# EAGLE board dac2_v2 (EAGLE 5.12)
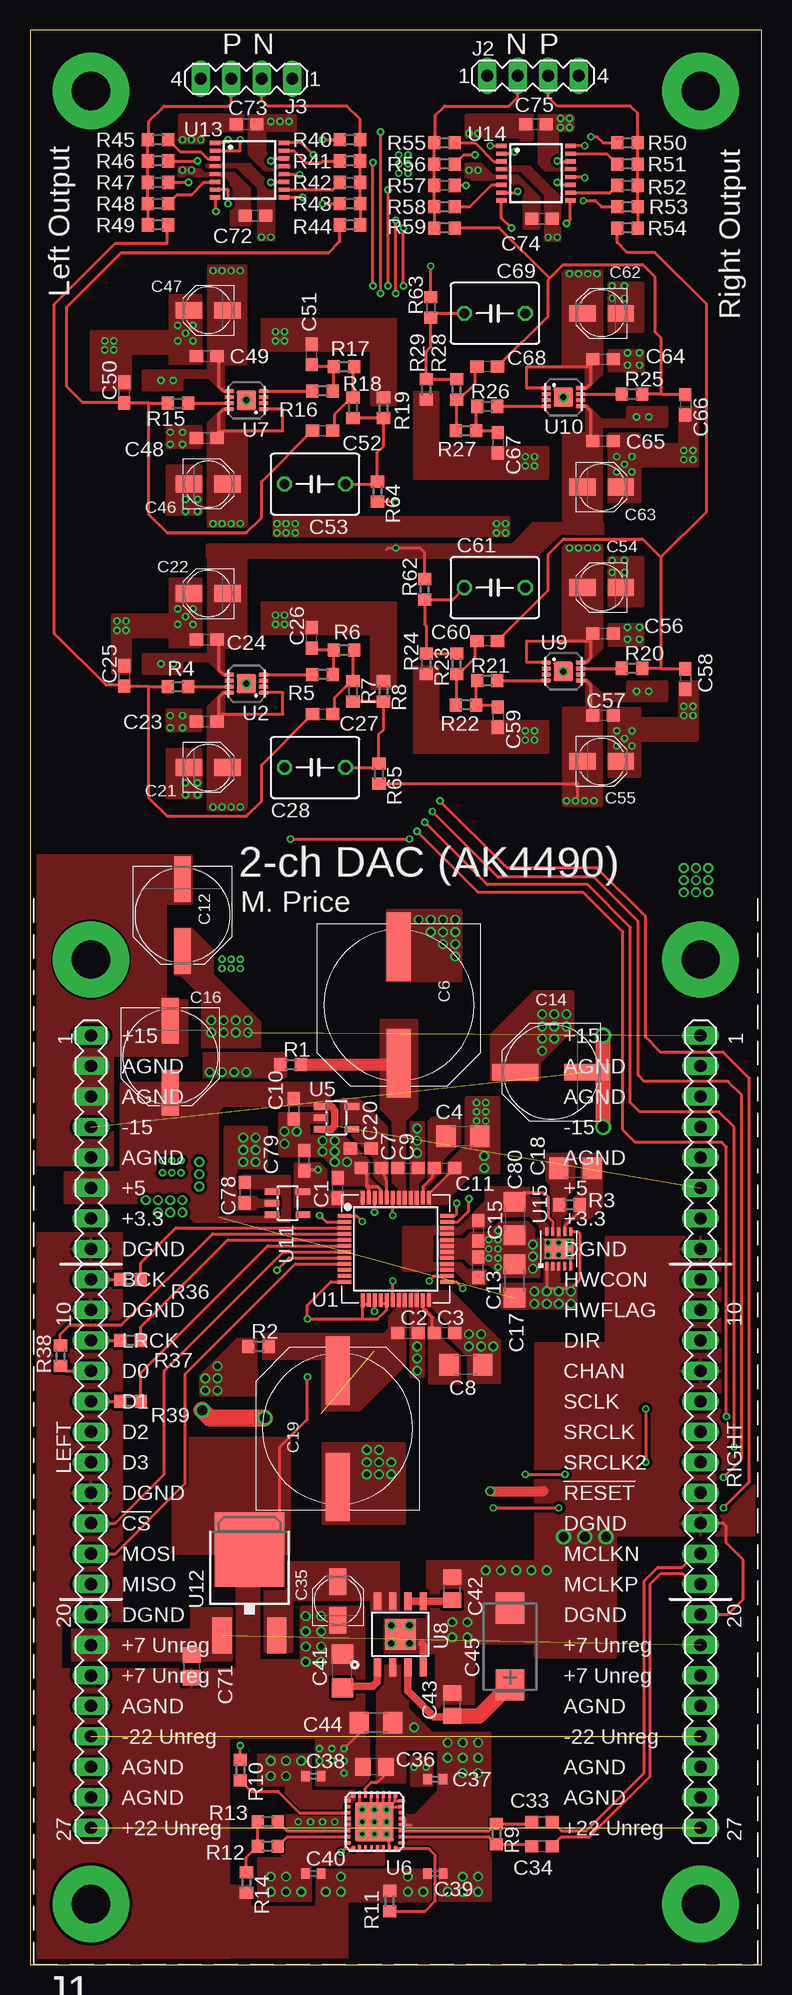
[diagram p2: board, top side]
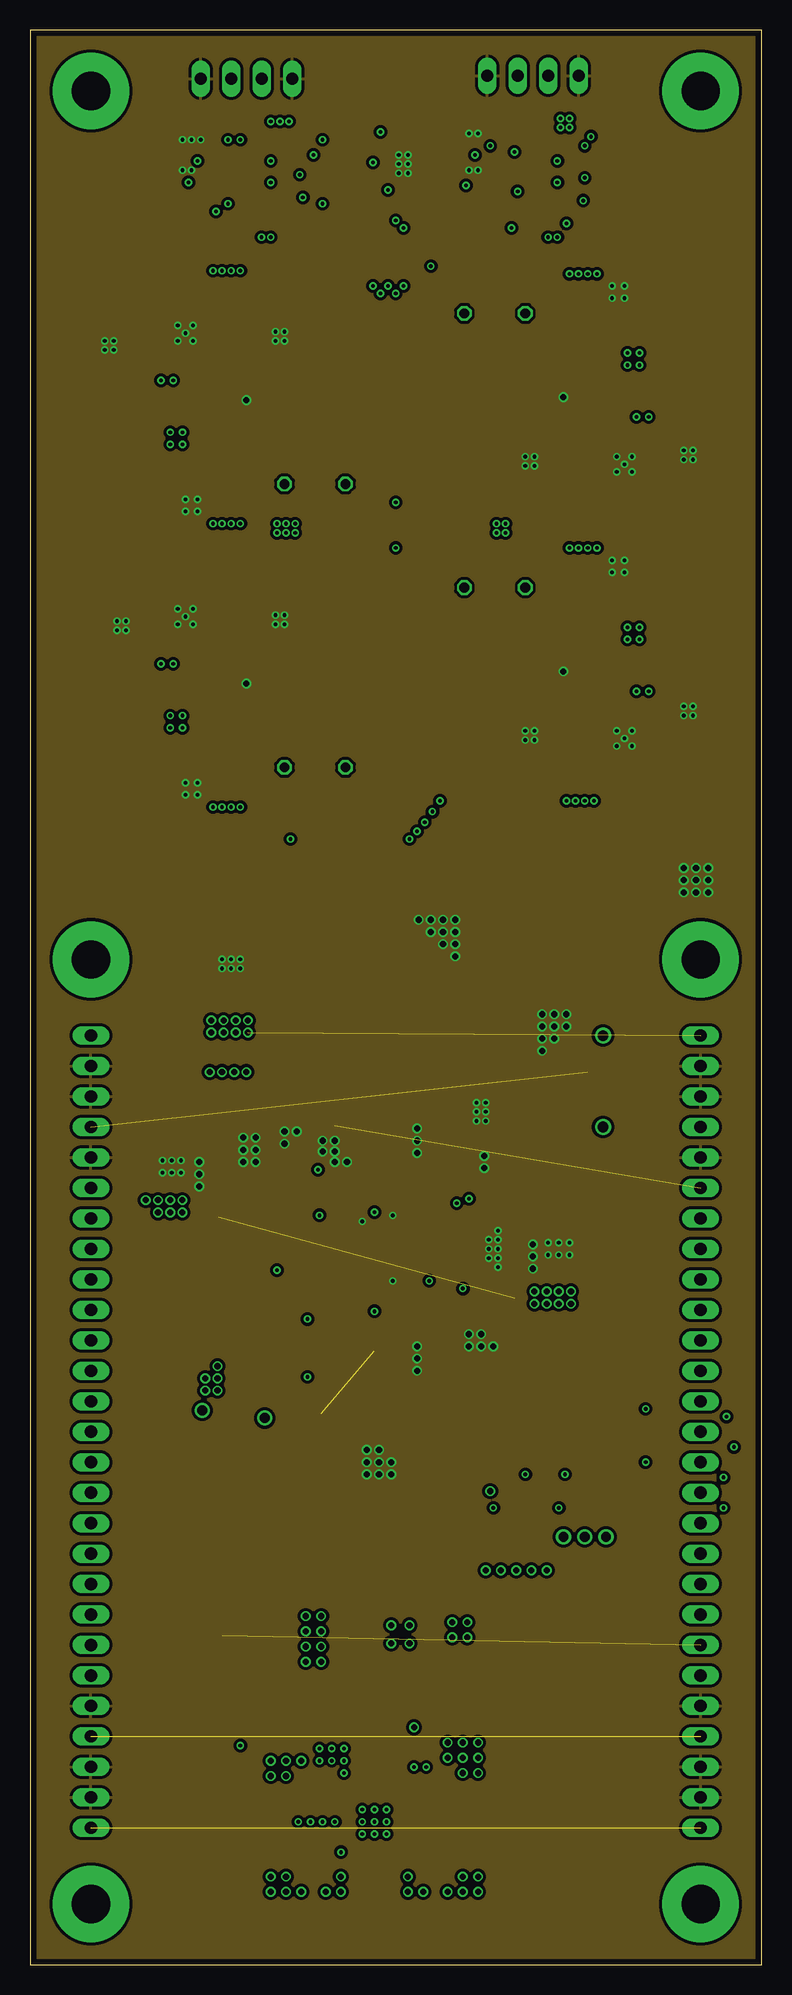
[diagram p3: board, inner layer Route2]
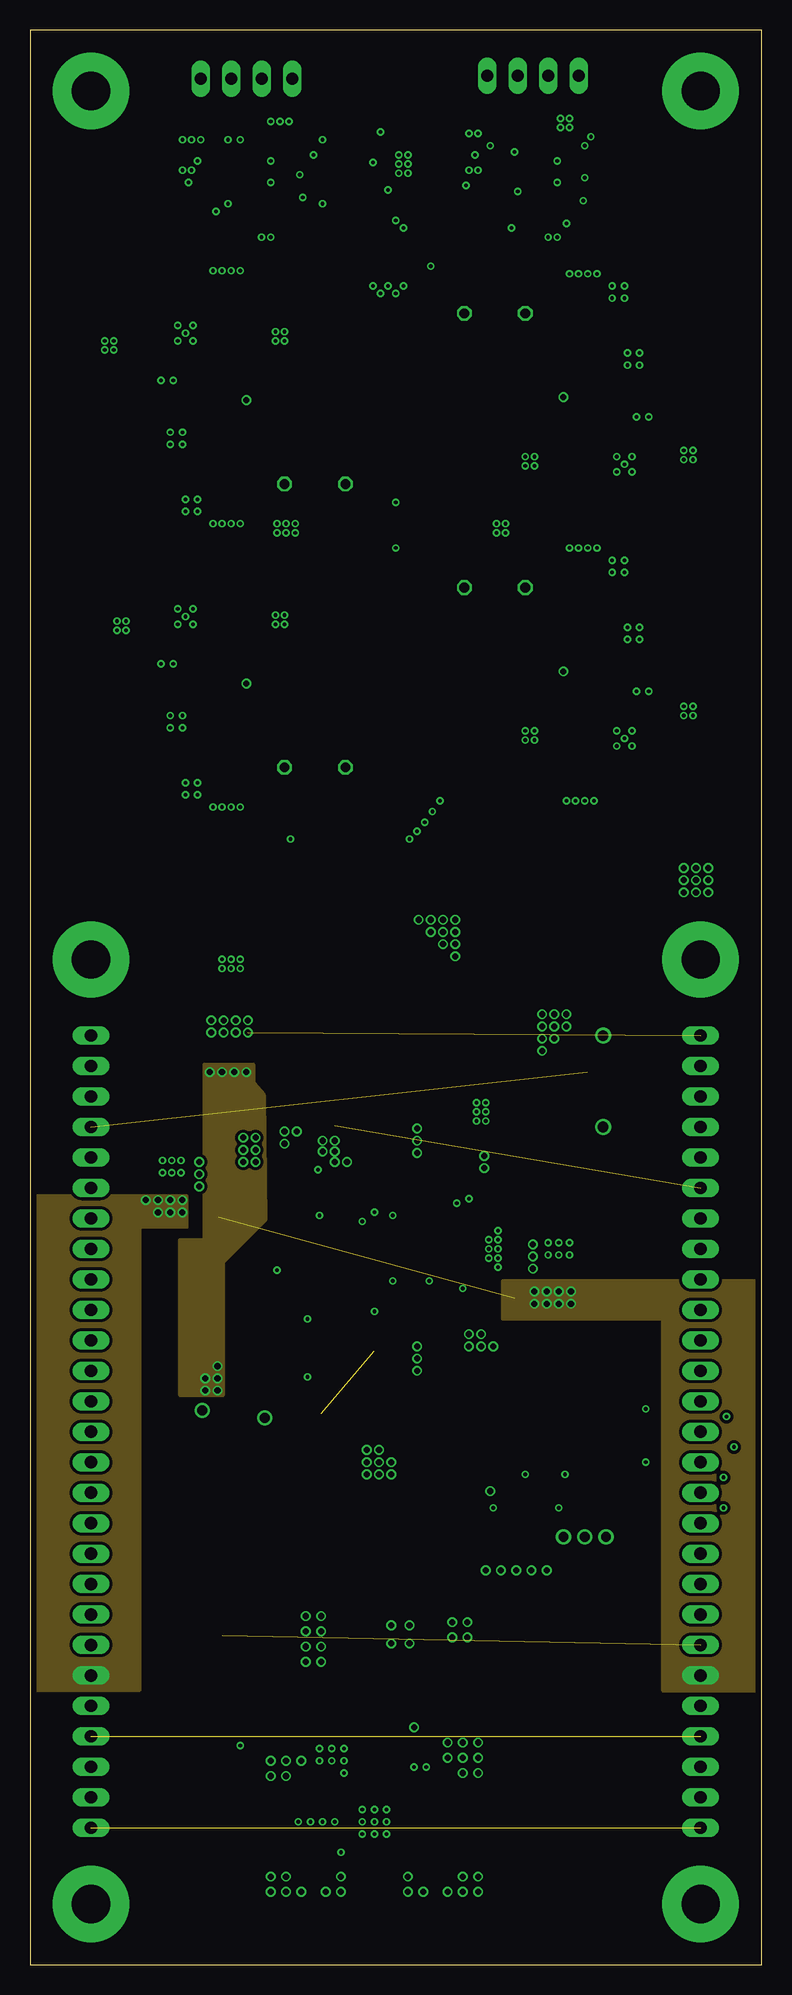
[diagram p4: board, inner layer Route15]
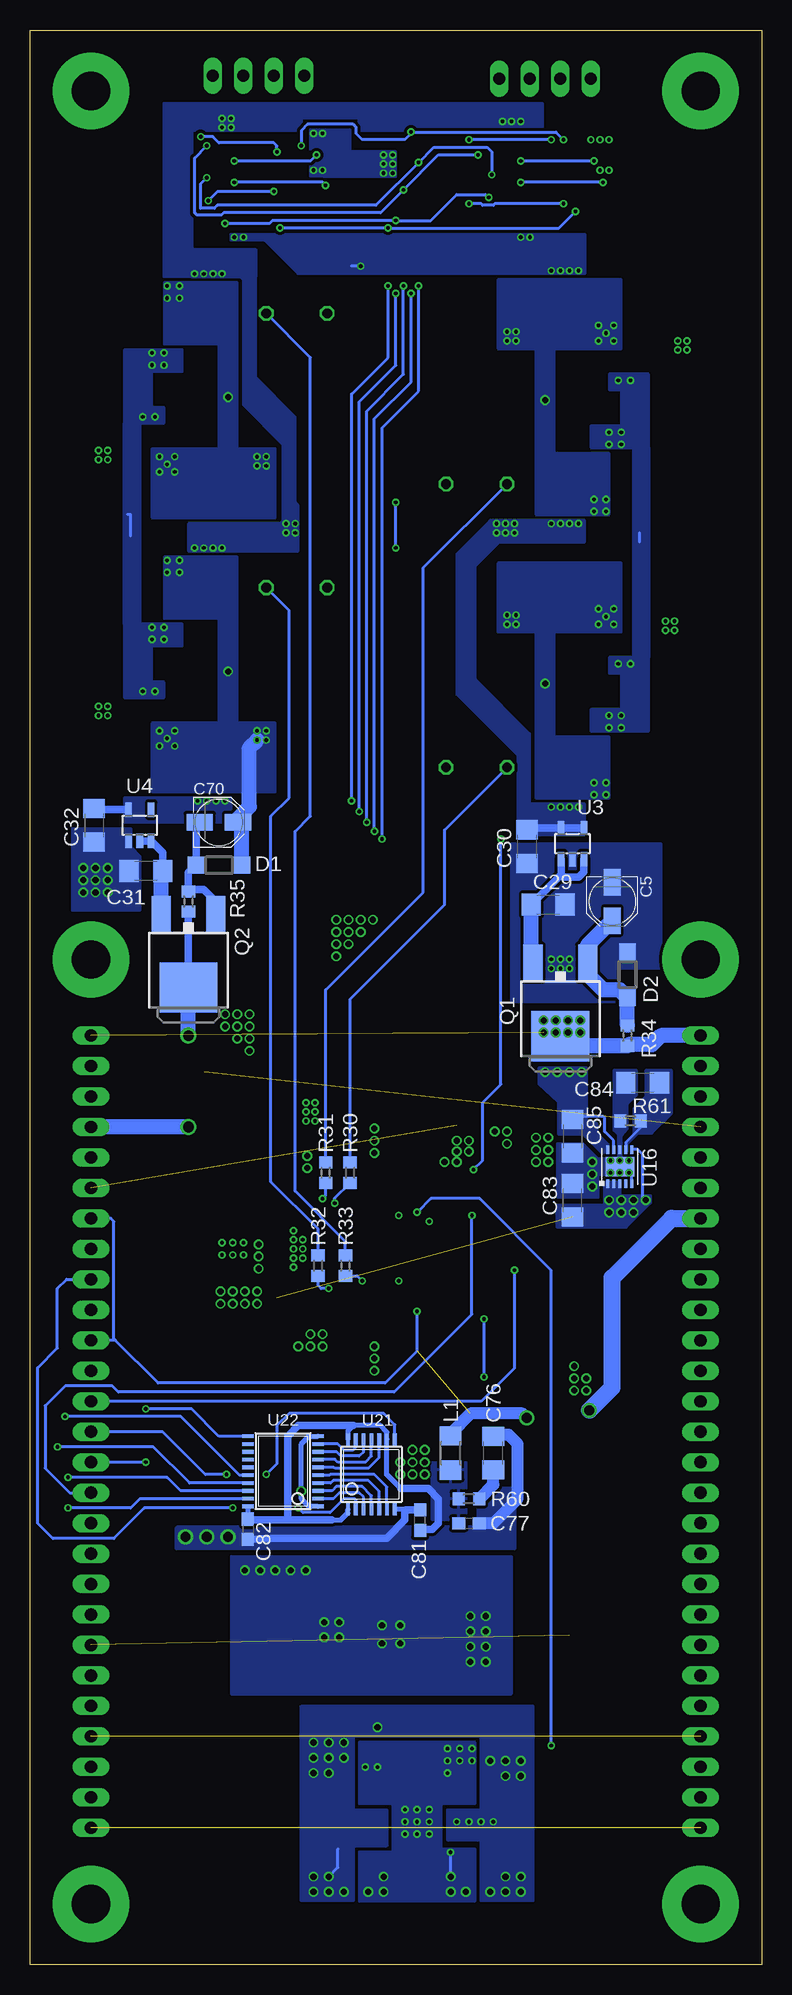
[diagram p5: board, bottom side, seen from below]

Size 60.96 x 161.29 mm. Coordinates in mm from the lower left corner, seen from the top.
Outline: 0,0 60.96,0 60.96,161.29 0,161.29 0,0
Copper layers (1*2*15*16): Top 0.035mm / dielectric 0.2mm / Route2 0.035mm / dielectric 1.2mm / Route15 0.035mm / dielectric 0.2mm / Bottom 0.035mm
Design rules "Elecrow_4-layer_PCB_eagle_rule": minimum track width 6mil, minimum drill 12mil, track to track 6mil, track to pad 6mil, pad to pad 6mil, via to via 8mil, smd to smd 0mil, copper to edge 20mil, drill to drill 10mil, minimum pad ring 6mil, minimum via ring 6mil, stop-mask expansion 0mil, vias tented up to drill 100mil, thermal gap 10mil

## Footprints (pad centres in the part's own frame; a part is rotated, then mirrored left to right if it is on the bottom)
C0603 = smd 1.1 x 1: 1 -0.85,0; 2 0.85,0
C1206 = smd 1.6 x 1.8: 1 -1.4,0; 2 1.4,0
PANASONIC_B = smd 2.2 x 1.4: + 1.6,0; - -1.6,0
PANASONIC_H13 = smd 5.7 x 2: + 4.85,0; - -4.85,0
PANASONIC_E = smd 3.8 x 1.4: + 3,0; - -3,0
C050-050X075 = drill 0.813 octagon: 1 -2.54,0; 2 2.54,0
C0805 = smd 1.3 x 1.5: 1 -0.95,0; 2 0.95,0
C0402 = smd 0.7 x 0.9: 1 -0.65,0; 2 0.65,0
CT7343 = smd 2.6 x 2.4: + -3.2,0; - 3.2,0
SOD123 = smd 1.4 x 1.4: A 1.9,0; C -1.9,0
MOD-V2 = drill 1.016 long: 1L -25.4,33.02; 1R 25.4,33.02; 2L -25.4,30.48; 2R 25.4,30.48; 3L -25.4,27.94; 3R 25.4,27.94; 4L -25.4,25.4; 4R 25.4,25.4; 5L -25.4,22.86; 5R 25.4,22.86; 6L -25.4,20.32; 6R 25.4,20.32; 7L -25.4,17.78; 7R 25.4,17.78; 8L -25.4,15.24; 8R 25.4,15.24; 9L -25.4,12.7; 9R 25.4,12.7; 10L -25.4,10.16; 10R 25.4,10.16; 11L -25.4,7.62; 11R 25.4,7.62; 12L -25.4,5.08; 12R 25.4,5.08; 13L -25.4,2.54; 13R 25.4,2.54; 14L -25.4,0; 14R 25.4,0; 15L -25.4,-2.54; 15R 25.4,-2.54; 16L -25.4,-5.08; 16R 25.4,-5.08; 17L -25.4,-7.62; 17R 25.4,-7.62; 18L -25.4,-10.16; 18R 25.4,-10.16; 19L -25.4,-12.7; 19R 25.4,-12.7; 20L -25.4,-15.24; 20R 25.4,-15.24; 21L -25.4,-17.78; 21R 25.4,-17.78; 22L -25.4,-20.32; 22R 25.4,-20.32; 23L -25.4,-22.86; 23R 25.4,-22.86; 24L -25.4,-25.4; 24R 25.4,-25.4; 25L -25.4,-27.94; 25R 25.4,-27.94; 26L -25.4,-30.48; 26R 25.4,-30.48; 27L -25.4,-33.02; 27R 25.4,-33.02 | drill 3.175 pad 6.35 round: DP1 -25.4,39.37; DP2 25.4,39.37; DP3 -25.4,-39.37; DP4 25.4,-39.37
MA04-1 = drill 1.016 long: 1 -3.81,0; 2 -1.27,0; 3 1.27,0; 4 3.81,0
R1206 = smd 1.6 x 1.803: 1 -1.422,0; 2 1.422,0
DPAK = smd 1.6 x 3: 1 -2.28,-4.04; 3 2.28,-4.04 | smd 4.826 x 4.191: 2 0,2.096
R0603 = smd 1 x 1.1: 1 -0.85,0; 2 0.85,0
P-QFP48-7X7MM = smd 1.1 x 0.3: 1 -4.275,2.75; 2 -4.275,2.25; 3 -4.275,1.75; 4 -4.275,1.25; 5 -4.275,0.75; 6 -4.275,0.25; 7 -4.275,-0.25; 8 -4.275,-0.75; 9 -4.275,-1.25; 10 -4.275,-1.75; 11 -4.275,-2.25; 12 -4.275,-2.75; 25 4.275,-2.75; 26 4.275,-2.25; 27 4.275,-1.75; 28 4.275,-1.25; 29 4.275,-0.75; 30 4.275,-0.25; 31 4.275,0.25; 32 4.275,0.75; 33 4.275,1.25; 34 4.275,1.75; 35 4.275,2.25; 36 4.275,2.75 | smd 0.3 x 1.1: 13 -2.75,-4.275; 14 -2.25,-4.275; 15 -1.75,-4.275; 16 -1.25,-4.275; 17 -0.75,-4.275; 18 -0.25,-4.275; 19 0.25,-4.275; 20 0.75,-4.275; 21 1.25,-4.275; 22 1.75,-4.275; 23 2.25,-4.275; 24 2.75,-4.275; 37 2.75,4.275; 38 2.25,4.275; 39 1.75,4.275; 40 1.25,4.275; 41 0.75,4.275; 42 0.25,4.275; 43 -0.25,4.275; 44 -0.75,4.275; 45 -1.25,4.275; 46 -1.75,4.275; 47 -2.25,4.275; 48 -2.75,4.275
LFCSP8 = smd 0.8 x 0.34: 1 -1.425,0.75; 2 -1.425,0.25; 3 -1.425,-0.25; 4 -1.425,-0.75; 5 1.425,-0.75; 6 1.425,-0.25; 7 1.425,0.25; 8 1.425,0.75 | smd 1.6 x 1.6: EXP 0,0
SOT23-DBV = smd 0.55 x 1.2: 1 -0.95,-1.3; 2 0,-1.3; 3 0.95,-1.3; 4 0.95,1.3; 5 -0.95,1.3
LFCSP32 = smd 0.55 x 0.3: 1 -2.25,1.75; 2 -2.25,1.25; 3 -2.25,0.75; 4 -2.25,0.25; 5 -2.25,-0.25; 6 -2.25,-0.75; 7 -2.25,-1.25; 8 -2.25,-1.75; 17 2.25,-1.75; 18 2.25,-1.25; 19 2.25,-0.75; 20 2.25,-0.25; 21 2.25,0.25; 22 2.25,0.75; 23 2.25,1.25; 24 2.25,1.75 | smd 0.3 x 0.55: 9 -1.75,-2.25; 10 -1.25,-2.25; 11 -0.75,-2.25; 12 -0.25,-2.25; 13 0.25,-2.25; 14 0.75,-2.25; 15 1.25,-2.25; 16 1.75,-2.25; 25 1.75,2.25; 26 1.25,2.25; 27 0.75,2.25; 28 0.25,2.25; 29 -0.25,2.25; 30 -0.75,2.25; 31 -1.25,2.25; 32 -1.75,2.25 | smd 3.25 x 3.25: EXP 0,0
SO8-EP = smd 0.61 x 1.524: 1 -1.905,-2.743; 2 -0.635,-2.743; 3 0.635,-2.743; 4 1.905,-2.743; 5 1.905,2.743; 6 0.635,2.743; 7 -0.635,2.743; 8 -1.905,2.743 | smd 2.54 x 2.54: EP 0,0
DPACK = smd 1.6 x 3: 1 -2.28,-4.8; 3 2.28,-4.8 | smd 5.8 x 6.2: 4 0,2.38
TSSOP16 = smd 0.9 x 0.35: 1 -2.875,2.275; 2 -2.875,1.625; 3 -2.875,0.975; 4 -2.875,0.325; 5 -2.875,-0.325; 6 -2.875,-0.975; 7 -2.875,-1.625; 8 -2.875,-2.275; 9 2.875,-2.275; 10 2.875,-1.625; 11 2.875,-0.975; 12 2.875,-0.325; 13 2.875,0.325; 14 2.875,0.975; 15 2.875,1.625; 16 2.875,2.275
DFN10 = smd 0.25 x 0.7: 1 -1,-1.425; 2 -0.5,-1.425; 3 0,-1.425; 4 0.5,-1.425; 5 1,-1.425; 6 1,1.425; 7 0.5,1.425; 8 0,1.425; 9 -0.5,1.425; 10 -1,1.425 | smd 2.38 x 1.65: EP 0,0
TSSOP14 = smd 0.305 x 0.991: 1 -1.95,-2.918; 2 -1.3,-2.918; 3 -0.65,-2.918; 4 0,-2.918; 5 0.65,-2.918; 6 1.3,-2.918; 7 1.95,-2.918; 8 1.95,2.918; 9 1.3,2.918; 10 0.65,2.918; 11 0,2.918; 12 -0.65,2.918; 13 -1.3,2.918; 14 -1.95,2.918
TSSOP20 = smd 0.305 x 0.991: 1 -2.925,-2.918; 2 -2.275,-2.918; 3 -1.625,-2.918; 4 -0.975,-2.918; 5 -0.325,-2.918; 6 0.325,-2.918; 7 0.975,-2.918; 8 1.625,-2.918; 9 2.275,-2.918; 10 2.925,-2.918; 11 2.925,2.918; 12 2.275,2.918; 13 1.625,2.918; 14 0.975,2.918; 15 0.325,2.918; 16 -0.325,2.918; 17 -0.975,2.918; 18 -1.625,2.918; 19 -2.275,2.918; 20 -2.925,2.918

## Placement (x,y rotation side)
C1  0.1u  [C0603]  25.65,64.77 90 top
C2  0.1u  [C0603]  31.5,52.7 0 top
C3  0.1u  [C0603]  34.54,52.7 0 top
C4  10u  [C1206]  36.07,69.09 0 top
C5  10u  [PANASONIC_B]  12.45,88.65 270 bottom
C6  2200u  [PANASONIC_H13]  30.73,80.01 270 top
C7  0.1u  [C0603]  28.45,66.42 180 top
C8  10u  [C1206]  36.32,50.04 0 top
C9  0.1u  [C0603]  31.5,66.42 0 top
C10  1u  [C0603]  21.97,71.37 270 top
C11  0.1u  [C0603]  34.54,66.42 0 top
C12  100u  [PANASONIC_E]  12.7,87.5 270 top
C13  0.1u  [C0603]  37.34,58.17 90 top
C14  100u  [PANASONIC_E]  43.43,74.42 180 top
C15  0.1u  [C0603]  37.34,61.21 270 top
C16  220u  [PANASONIC_E]  11.68,75.69 270 top
C17  4.7u  [C1206]  40.39,57.02 90 top
C18  4.7u  [C1206]  45.47,66.42 180 top
C19  2200u  [PANASONIC_H13]  25.65,44.7 90 top
C20  1u  [C0603]  27.56,68.07 180 top
C21  10u  [PANASONIC_B]  14.86,99.82 0 top
C22  10u  [PANASONIC_B]  14.86,114.3 180 top
C23  0.1u  [C0603]  14.73,103.63 180 top
C24  0.1u  [C0603]  14.73,110.49 0 top
C25  1n  [C0603]  7.87,107.44 90 top
C26  3.3n  [C0603]  23.5,110.62 90 top
C27  4.7n  [C0603]  24.38,104.27 0 top
C28  1u  [C050-050X075]  23.75,99.82 0 top
C29  10u  [C1206]  17.78,88.39 0 bottom
C30  10u  [C1206]  19.56,93.22 270 bottom
C31  10u  [C1206]  51.31,91.19 180 bottom
C32  10u  [C1206]  55.63,95 270 bottom
C33  10n  [C0603]  42.67,11.94 0 top
C34  10n  [C0603]  42.67,9.91 0 top
C35  10u  [PANASONIC_B]  25.65,30.35 90 top
C36  1u  [C0805]  28.7,16.51 180 top
C37  10n  [C0402]  33.78,15.49 180 top
C38  10n  [C0402]  23.62,15.75 0 top
C39  10n  [C0402]  33.78,7.62 180 top
C40  10n  [C0402]  23.62,7.62 0 top
C41  10u  [C1206]  26.04,24.51 90 top
C42  1u  [C0805]  35.18,31.37 90 top
C43  1u  [C0805]  35.18,21.72 90 top
C44  10u  [C1206]  28.83,20.19 180 top
C45  330u  [CT7343]  40.01,26.54 90 top
C46  10u  [PANASONIC_B]  14.86,123.44 0 top
C47  10u  [PANASONIC_B]  14.86,137.92 180 top
C48  0.1u  [C0603]  14.73,127.25 180 top
C49  0.1u  [C0603]  14.73,134.11 0 top
C50  1n  [C0603]  7.87,131.06 90 top
C51  3.3n  [C0603]  23.5,134.24 90 top
C52  4.7n  [C0603]  24.38,127.89 0 top
C53  1u  [C050-050X075]  23.75,123.44 0 top
C54  10u  [PANASONIC_B]  47.62,114.81 180 top
C55  10u  [PANASONIC_B]  47.62,100.33 0 top
C56  0.1u  [C0603]  47.75,111 0 top
C57  0.1u  [C0603]  47.75,104.14 180 top
C58  1n  [C0603]  54.61,107.19 270 top
C59  3.3n  [C0603]  38.99,104.01 270 top
C60  4.7n  [C0603]  38.1,110.36 180 top
C61  1u  [C050-050X075]  38.73,114.81 180 top
C62  10u  [PANASONIC_B]  47.62,137.67 180 top
C63  10u  [PANASONIC_B]  47.62,123.19 0 top
C64  0.1u  [C0603]  47.75,133.86 0 top
C65  0.1u  [C0603]  47.75,127 180 top
C66  1n  [C0603]  54.61,130.05 270 top
C67  3.3n  [C0603]  38.99,126.87 270 top
C68  4.7n  [C0603]  38.1,133.22 180 top
C69  1u  [C050-050X075]  38.73,137.67 180 top
C70  10u  [PANASONIC_B]  45.21,95.25 0 bottom
C71  1u  [C0805]  13.46,24.89 270 top
C72  0.1u  [C0603]  18.8,145.8 180 top
C73  0.1u  [C0603]  18.03,153.42 180 top
C74  0.1u  [C0603]  42.67,145.54 180 top
C75  0.1u  [C0603]  42.16,153.42 180 top
C76  10u  [C1206]  22.35,42.67 90 bottom
C77  1u  [C0603]  24.38,36.83 0 bottom
C78  1u  [C0603]  17.91,64.39 270 top
C79  1u  [C0603]  22.86,67.06 90 top
C80  4.7u  [C1206]  40.39,62.23 270 top
C81  0.1u  [C0603]  28.45,37.08 90 bottom
C82  0.1u  [C0603]  42.8,36.32 270 bottom
C83  4.7u  [C1206]  15.75,63.75 90 bottom
C84  4.7u  [C1206]  9.91,73.53 180 bottom
C85  4.7u  [C1206]  15.75,69.09 270 bottom
D1  MMSZ5235B  [SOD123]  45.21,91.69 180 bottom
D2  MMSZ5235B  [SOD123]  11.18,82.55 90 bottom
J1  MOD-V2  [MOD-V2]  30.48,44.45 0 top
J2  [MA04-1]  41.91,157.48 0 top
J3  [MA04-1]  18.03,157.23 180 top
L1  BEAD  [R1206]  25.91,42.67 270 bottom
Q1  D44H11MT  [DPAK]  16.76,79.5 180 bottom
Q2  D45H11MT  [DPAK]  47.75,83.57 180 bottom
R1  0  [R0603]  21.72,75.06 0 top
R2  0  [R0603]  19.05,51.56 0 top
R3  49.9k  [R0603]  44.96,63.37 0 top
R4  10  [R0603]  12.32,106.55 180 top
R5  24.9  [R0603]  24.38,107.57 180 top
R6  249  [R0603]  26.16,109.6 180 top
R7  249  [R0603]  26.92,106.17 90 top
R8  100k  [R0603]  29.46,106.17 270 top
R9  100  [R0603]  38.86,10.92 270 top
R10  22  [R0603]  17.53,16.26 270 top
R11  4.12k  [R0603]  29.97,5.33 270 top
R12  50  [R0603]  19.81,9.91 0 top
R13  50  [R0603]  19.81,11.94 0 top
R14  50  [R0603]  18.03,6.86 270 top
R15  10  [R0603]  12.32,130.18 180 top
R16  24.9  [R0603]  24.38,131.19 180 top
R17  249  [R0603]  26.16,133.22 180 top
R18  249  [R0603]  26.92,129.79 90 top
R19  100k  [R0603]  29.46,129.79 270 top
R20  10  [R0603]  50.16,108.08 0 top
R21  24.9  [R0603]  38.1,107.06 0 top
R22  249  [R0603]  36.32,105.03 0 top
R23  249  [R0603]  35.56,108.46 270 top
R24  100k  [R0603]  33.02,108.46 90 top
R25  10  [R0603]  50.16,130.94 0 top
R26  24.9  [R0603]  38.1,129.92 0 top
R27  249  [R0603]  36.32,127.89 0 top
R28  249  [R0603]  35.56,131.32 270 top
R29  100k  [R0603]  33.02,131.32 90 top
R30  100  [R0603]  34.29,66.04 90 bottom
R31  100  [R0603]  36.32,66.04 90 bottom
R32  100  [R0603]  36.96,58.29 90 bottom
R33  100  [R0603]  34.67,58.29 90 bottom
R34  825  [R0603]  11.18,77.47 90 bottom
R35  825  [R0603]  47.75,88.65 90 bottom
R36  50  [R0603]  8.38,57.15 180 top
R37  50  [R0603]  8.38,52.07 180 top
R38  50  [R0603]  2.54,50.8 270 top
R39  50  [R0603]  8.38,46.99 180 top
R40  45.3  [R0603]  26.67,152.15 180 top
R41  10.5  [R0603]  26.67,150.37 180 top
R42  2.49  [R0603]  26.67,148.59 180 top
R43  0  [R0603]  26.67,146.81 180 top
R44  90.9  [R0603]  26.67,145.03 180 top
R45  45.3  [R0603]  10.67,152.15 180 top
R46  10.5  [R0603]  10.67,150.37 180 top
R47  2.49  [R0603]  10.67,148.59 180 top
R48  0  [R0603]  10.67,146.81 180 top
R49  90.9  [R0603]  10.67,145.03 0 top
R50  45.3  [R0603]  49.78,151.89 180 top
R51  10.5  [R0603]  49.78,150.11 180 top
R52  2.49  [R0603]  49.78,148.34 180 top
R53  0  [R0603]  49.78,146.56 180 top
R54  90.9  [R0603]  49.78,144.78 180 top
R55  45.3  [R0603]  34.54,151.89 180 top
R56  10.5  [R0603]  34.54,150.11 180 top
R57  2.49  [R0603]  34.54,148.34 180 top
R58  0  [R0603]  34.54,146.56 180 top
R59  90.9  [R0603]  34.54,144.78 0 top
R60  1  [R0603]  24.38,38.86 180 bottom
R61  49.9k  [R0603]  10.92,70.36 0 bottom
R62  50Meg  [R0603]  32.89,114.68 90 top
R63  50Meg  [R0603]  33.4,138.18 90 top
R64  50Meg  [R0603]  28.96,122.81 270 top
R65  50Meg  [R0603]  29.08,99.31 270 top
U1  AK4490  [P-QFP48-7X7MM]  30.48,59.69 0 top
U2  ADA4899-1  [LFCSP8]  18.03,106.81 180 top
U3  ADP7142  [SOT23-DBV]  15.75,93.47 0 bottom
U4  ADP7182  [SOT23-DBV]  51.82,95 0 bottom
U5  ADM7160  [SOT23-DBV]  25.53,70.61 270 top
U6  AD9515  [LFCSP32]  28.7,11.94 180 top
U7  ADA4899-1  [LFCSP8]  18.03,130.43 180 top
U8  ADM7154  [SO8-EP]  30.86,27.56 0 top
U9  ADA4899-1  [LFCSP8]  44.45,107.82 0 top
U10  ADA4899-1  [LFCSP8]  44.45,130.68 0 top
U11  ADM7160  [SOT23-DBV]  21.46,63.5 270 top
U12  LF50ABDT  [DPACK]  18.29,32.26 0 top
U13  DG9424E  [TSSOP16]  18.29,149.61 0 top
U14  DG9424E  [TSSOP16]  42.16,149.35 0 top
U15  LT3042DD  [DFN10]  44.07,59.69 0 top
U16  LT3042DD  [DFN10]  11.81,66.55 0 bottom
U21  74164FT  [TSSOP14]  32.51,40.89 0 bottom
U22  74LVTH574  [TSSOP20]  39.88,41.15 90 bottom

## Tracks (layer width: path | path; a pad name or v marks a point on that pad's centre or on a via)
!CS
  Top 0.254: J1.17L 7.11,36.83 11.18,40.89 11.18,49.53 21.09,59.44 U1.7
!RESET  (via drill 0.3 pad 0.51)
  Top 0.254: U1.2 24.67,61.94 v24.13,62.48
  Bottom 0.254: v24.13,62.48 24.13,54.23 30.61,47.75 53.59,47.75 54.1,48.26 58.04,48.26 59.69,46.61 59.69,41.4 57.66,39.37 J1.16R
A3V3
  Top 0.254: C7.1 29.73,65.35 U1.44
  pour Top (no thermals): 29.72,64.77 29.72,69.85 27.43,72.14 25.91,72.14 25.91,70.1 28.7,67.31 28.7,65.79
A5V  (1 unrouted)
  Top 0.61: U5.1 25.09,71.56 25.4,71.25 25.4,69.98 25.09,69.66 U5.3
  pour Top (isolate 0.254, no thermals): 17.78,65.79 21.59,65.79 21.59,61.98 13.72,61.98 12.19,63.5 2.92,63.5 2.92,66.04 7.62,66.04 7.62,73.53 24.89,73.53 24.89,71.63 16.13,71.63 15.62,71.12 15.62,62.36 21.08,62.36 21.08,64.26 19.68,64.26 19.68,64.77 17.78,64.77
A5VDAC
  Top 0.254: U15.9 43.57,61.97 43.18,62.36 43.18,64.01 42.8,64.39 41.15,64.39 C80.1
  pour Top (isolate 0.254, no thermals): 39.12,62.48 39.12,64.77 41.53,64.77 41.53,64.01 41.66,63.88 42.42,63.88 42.42,62.36 43.18,61.59 43.18,60.96 42.55,60.96 42.55,61.59 41.66,62.48
  pour Top (isolate 0.254, no thermals): 33.91,60.96 35.94,60.96 36.45,61.47 37.97,61.47 38.99,62.48 39.37,62.48 40.64,62.48 40.64,64.77 37.97,64.77 37.97,63.63 35.81,61.47 33.91,61.47
  pour Top (isolate 0.254, no thermals): 37.97,57.91 36.45,57.91 35.94,58.42 33.53,58.42 33.53,60.96 35.05,60.96 35.05,61.47 31.11,61.47 31.11,57.91 35.43,57.91 36.58,56.77 37.97,56.77
A5VREF  (via drill 0.51 pad 0.81)
  Bottom 0.254: U16.9 12.32,68.71 13.08,69.47 13.08,70.61 13.21,70.74 15.11,70.74 15.36,70.49 C85.1
  other vias: 14.99,74.42 16,74.42 17.02,74.42 18.03,74.42 14.61,48.9 14.61,47.88 15.62,47.88 15.62,48.9 15.62,49.91
  pour Bottom (isolate 0.254, no thermals): 14.61,74.8 14.61,70.23 13.84,70.23 13.72,70.1 13.72,69.34 12.83,68.45 12.83,67.69 13.34,67.69 14.86,69.22 16.89,69.22 16.89,71.88 18.54,73.41 18.54,74.8
  pour Top (isolate 0.254, no thermals): 21.34,75.95 14.48,75.95 14.48,74.04 21.34,74.04
  pour Top (isolate 0.254, no thermals): 18.8,52.2 18.8,47.5 14.22,47.5 14.22,49.15 17.27,52.2
  pour Route15 (isolate 0.254, no thermals): 16.13,47.5 16.13,58.55 19.68,62.1 19.56,72.52 18.67,73.53 18.67,75.06 14.48,75.06 14.48,60.45 12.45,60.45 12.45,47.5
A7VU  (via drill 0.51 pad 0.81)  (1 unrouted)
  Top 0.254: U15.6 45.69,61.12 45.85,60.96 45.85,57.15 45.09,56.39 43.18,56.39 43.05,56.52 43.05,58.25 U15.1
  Bottom 0.254: U16.2 | U16.6 10.31,67.97 9.91,67.56 9.91,64.01 v9.65,63.75
  other vias: 11.68,63.75 12.7,63.75 10.67,63.75 42.04,55.12 42.04,56.13 43.05,56.13 43.05,55.12 44.07,55.12 44.07,56.13 45.09,56.13 45.09,55.12 10.67,62.74 11.68,62.74 12.7,62.74
  pour Bottom (isolate 0.254, no thermals): 17.02,63.37 13.08,63.37 13.08,65.28 11.81,65.28 11.81,64.14 9.27,64.14 9.27,63.5 11.3,61.47 17.02,61.47
  pour Top (isolate 0.254, no thermals): 39.37,56.77 42.93,56.77 42.93,58.42 44.07,58.42 44.07,56.77 45.47,56.77 45.47,54.74 44.07,54.74 39.37,54.74
  pour Route15 (isolate 0.254, no thermals): 9.14,22.86 0.13,22.86 0.13,64.14 13.08,64.14 13.08,61.47 9.14,61.47
  pour Route15 (isolate 0.254, no thermals): 52.83,22.86 60.83,22.86 60.83,57.02 39.37,57.02 39.37,53.85 52.07,53.85 52.7,53.85 52.7,22.86
AGND  (via drill 0.3 pad 0.51, 0.51 pad 0.81)
  Top 0.254: U15.5 45.07,59.42 45.09,59.44 44.32,59.44 U15.EP | U1.1 27.22,62.44 v27.69,61.98 | U1.18 v30.23,57.02 | 28.96,64.9 28.32,64.9 28.07,65.15 | U1.43 v30.23,62.49 v30.23,62.48 | U1.37 33.23,64.26 C11.2
  Top 0.305: U1.47 28.23,64.73 28.07,64.9 28.07,65.15 28.07,65.95 C7.2 | U1.45 29.23,64.62 28.96,64.9
  Bottom 0.254: U16.5 10.81,66.15 10.79,66.17 11.43,66.17 U16.EP
  Bottom 1.27: D1.C 43.31,94.95 C70.+ 43.61,95.58 42.67,96.52 42.67,101.47 v42.04,102.11
  other vias: 18.03,106.81 12.32,111.76 13.59,111.76 13.59,113.03 12.32,113.03 13.97,98.55 12.95,98.55 12.95,97.54 13.97,97.54 21.21,111.76 20.45,111.76 20.45,112.52 21.21,112.52 12.95,112.39 18.03,130.43 12.32,135.38 13.59,135.38 13.59,136.65 12.32,136.65 13.97,122.17 12.95,122.17 12.95,121.16 13.97,121.16 21.21,135.38 20.45,135.38 20.45,136.14 21.21,136.14 12.95,136.02 44.45,107.82 50.16,102.87 48.9,102.87 48.9,101.6 50.16,101.6 48.51,116.08 49.53,116.08 49.53,117.09 48.51,117.09 41.27,102.87 42.04,102.87 41.27,102.11 49.53,102.23 44.45,130.68 50.16,125.73 48.9,125.73 48.9,124.46 50.16,124.46 48.51,138.94 49.53,138.94 49.53,139.95 48.51,139.95 41.27,125.73 42.04,125.73 42.04,124.97 41.27,124.97 49.53,125.09 54.48,126.24 55.24,126.24 55.24,125.48 54.48,125.48 54.48,104.9 55.24,104.9 55.24,104.14 54.48,104.14 6.99,134.62 6.22,134.62 6.22,135.38 6.99,135.38 8,111.25 7.24,111.25 7.24,112.01 8,112.01 16,83.82 16.76,83.82 17.53,83.82 16,83.06 16.76,83.06 17.53,83.06 12.7,149.61 13.46,149.61 12.7,152.15 13.46,152.15 14.22,152.15 36.58,152.65 36.58,149.61 37.34,149.61 37.34,152.65 30.73,149.35 31.5,149.35 31.5,150.11 30.73,150.11 30.73,150.88 31.5,150.88 32.26,67.69 32.26,68.71 32.26,69.72 32.38,87.12 33.4,87.12 34.42,87.12 35.43,87.12 35.43,86.11 35.43,85.09 35.43,84.07 34.42,86.11 33.4,86.11 34.42,85.09 37.21,71.88 37.97,71.88 37.21,71.12 37.97,71.12 37.21,70.36 37.97,70.36 37.85,66.42 37.85,67.44 38.23,60.45 38.99,60.45 38.23,59.69 38.99,59.69 38.23,58.93 38.99,58.93 38.99,61.21 38.99,58.17 41.91,58.04 41.91,59.05 41.91,60.07 43.18,60.2 43.18,59.18 44.07,60.2 44.96,60.2 44.96,59.18 44.07,59.18 11.05,67.06 11.81,67.06 12.57,67.06 12.57,66.04 11.81,66.04 11.05,66.04 28.07,42.93 29.08,42.93 29.08,41.91 28.07,41.91 28.07,40.89 29.08,40.89 30.1,41.91 30.1,40.89 32.26,51.56 32.26,50.55 32.26,49.53 36.58,52.58 37.59,52.58 37.59,51.56 36.58,51.56 38.61,51.56 26.42,66.93 25.4,66.93 25.4,67.82 25.4,68.71 24.38,68.71 24.38,67.82 22.23,69.47 21.21,69.47 21.21,68.45 54.48,91.44 55.5,91.44 56.52,91.44 56.52,90.42 55.5,90.42 54.48,90.42 54.48,89.41 55.5,89.41 56.52,89.41 42.67,76.2 42.67,77.22 43.69,77.22 42.67,78.23 43.69,78.23 44.7,78.23 42.67,79.25 43.69,79.25 44.7,79.25 14.1,64.9 14.1,65.91 14.1,66.93 17.78,67.94 17.78,66.93 18.8,66.93 18.8,67.94 18.8,68.96 17.78,68.96
  pour Bottom: 18.8,97.28 17.27,97.28 17.27,111.76 18.8,111.76
  pour Bottom: 18.67,97.28 12.7,97.28 12.7,102.36 18.67,102.36
  pour Bottom: 21.97,111.12 11.68,111.12 11.68,116.84 21.97,116.84
  pour Top (no thermals): 14.22,109.86 11.68,109.86 11.68,115.57 14.22,115.57
  pour Top (no thermals): 14.22,97.28 11.43,97.28 11.43,101.35 14.22,101.35
  pour Top (no thermals): 30.48,106.43 30.48,113.54 19.3,113.54 19.3,111 28.45,111 28.45,106.43
  pour Top (no thermals): 8.38,107.7 8.38,110.74 12.95,110.74 12.95,112.52 6.86,112.52 6.86,107.7
  pour Bottom: 18.8,120.9 17.27,120.9 17.27,135.38 18.8,135.38
  pour Bottom: 18.67,120.9 12.7,120.9 12.7,125.98 18.67,125.98
  pour Bottom: 21.97,134.75 11.68,134.75 11.68,140.46 21.97,140.46
  pour Top (no thermals): 14.22,133.48 11.68,133.48 11.68,139.19 14.22,139.19
  pour Top (no thermals): 14.22,120.9 11.43,120.9 11.43,124.97 14.22,124.97
  pour Top (no thermals): 30.48,130.05 30.48,137.16 19.3,137.16 19.3,134.62 28.45,134.62 28.45,130.05
  pour Top (no thermals): 8.38,131.32 8.38,134.37 12.95,134.37 12.95,136.14 5.08,136.14 5.08,131.32
  pour Bottom: 43.69,117.35 45.21,117.35 45.21,102.87 43.69,102.87
  pour Bottom: 43.81,117.35 49.78,117.35 49.78,112.27 43.81,112.27
  pour Bottom: 40.51,103.5 50.8,103.5 50.8,97.79 40.51,97.79
  pour Top (no thermals): 48.26,104.78 50.8,104.78 50.8,99.06 48.26,99.06
  pour Top (no thermals): 48.26,117.35 51.05,117.35 51.05,113.28 48.26,113.28
  pour Top (no thermals): 32,108.2 32,101.09 43.18,101.09 43.18,103.63 34.04,103.63 34.04,108.2
  pour Top (no thermals): 54.1,106.93 54.1,103.89 49.53,103.89 49.53,102.11 55.63,102.11 55.63,106.93
  pour Bottom: 43.69,140.21 45.21,140.21 45.21,125.73 43.69,125.73
  pour Bottom: 43.81,140.21 49.78,140.21 49.78,135.13 43.81,135.13
  pour Bottom: 40.51,126.36 50.8,126.36 50.8,120.65 40.51,120.65
  pour Top (no thermals): 48.26,127.64 50.8,127.64 50.8,121.92 48.26,121.92
  pour Top (no thermals): 48.26,140.21 51.05,140.21 51.05,136.14 48.26,136.14
  pour Top (no thermals): 32,131.06 32,123.95 43.18,123.95 43.18,126.49 34.04,126.49 34.04,131.06
  pour Top (no thermals): 54.1,129.79 54.1,126.75 49.53,126.75 49.53,124.97 55.63,124.97 55.63,129.79
  pour Top (no thermals): 39.12,61.85 38.23,60.96 36.7,60.96 36.2,60.45 34.16,60.45 34.16,58.93 36.2,58.93 36.7,58.42 38.23,58.42 39.24,57.4 42.42,57.4 42.42,58.93 45.34,58.93 45.34,60.45 42.04,60.45 42.04,61.34 41.53,61.85
  pour Top (no thermals): 20.83,70.99 25.15,70.99 25.15,70.23 23.24,70.23 23.24,69.09 26.16,69.09 28.19,67.06 28.19,65.66 29.08,64.77 28.07,64.77 27.81,65.02 25.27,65.02 25.27,66.55 24.38,67.44 20.83,67.44
  pour Top (no thermals): 36.32,72.26 36.32,68.33 34.8,66.8 34.8,65.79 33.4,64.39 33.4,63.5 34.8,63.5 34.8,63.88 36.96,66.04 39.12,66.04 39.12,72.26
  pour Top (no thermals): 33.27,56.13 35.05,56.13 39.12,52.07 39.12,48.51 36.58,48.51 36.58,50.67 34.92,52.32 34.92,53.47 33.27,55.12
  pour Top (no thermals): 31.75,70.23 32.77,70.23 32.77,65.66 32.26,65.15 32.26,63.25 31.75,63.25
  pour Top (no thermals): 31.75,56.26 32.26,56.26 32.26,54.36 32.77,53.85 32.77,49.02 31.75,49.02
  pour Bottom (no thermals): 57.4,94.74 52.58,94.74 52.58,93.22 51.82,92.46 51.82,87.88 57.4,87.88
  pour Bottom (isolate 0.254, no thermals): 20.83,93.47 8.38,93.47 8.38,83.06 12.19,83.06 12.19,80.26 20.83,80.26
  pour Top (no thermals): 24.38,36.83 31.24,36.83 31.24,43.43 24.38,43.43
  pour Top (isolate 0.254, no thermals): 12.45,149.86 13.97,149.86 14.48,149.35 17.02,149.35 18.29,148.08 18.29,145.03 16.76,145.03 16.76,148.59 16.26,149.1 12.45,149.1
  pour Top (isolate 0.254, no thermals): 17.78,154.18 12.45,154.18 12.45,151.89 14.48,151.89 14.48,152.4 14.99,152.91 17.78,152.91
  pour Top (isolate 0.254, no thermals): 36.32,148.84 39.88,148.84 41.15,147.57 41.15,144.78 42.42,144.78 42.42,147.32 40.64,149.1 38.61,149.1 37.59,150.11 36.32,150.11
  pour Top (isolate 0.254, no thermals): 41.91,152.15 41.91,154.18 36.32,154.18 36.32,152.4 40.89,152.4 40.89,152.15
  pour Bottom (isolate 0.254, no thermals): 37.59,153.16 37.59,149.1 30.48,149.1 30.48,151.13 34.29,151.13 34.29,153.16
  pour Route2 (isolate 0.254): 0,0 60.96,0 60.96,161.29 0,161.29
  pour Top (no thermals): 45.34,67.56 43.05,67.56 43.05,65.41 43.43,65.02 43.43,62.61 43.94,62.1 43.94,60.45 44.15,60.45 44.15,62.1 44.7,62.64 44.7,64.14 45.34,64.77
  pour Bottom (no thermals): 11.71,67.31 11.71,69.16 11.18,69.72 11.18,71.75 10.41,72.52 10.41,74.55 12.32,74.55 12.32,69.6 11.94,69.22 11.94,67.31
  pour Bottom (isolate 0.254, no thermals): 11.56,67.18 13.59,67.18 14.86,68.45 17.02,68.45 17.02,64.01 13.59,64.01 13.59,65.91 11.56,65.91
  pour Top (isolate 0.254, no thermals): 29.72,87.88 29.72,82.04 35.94,82.04 35.94,87.88
  pour Top (isolate 0.254, no thermals): 20.57,63.25 18.92,63.25 18.67,62.99 16.26,62.99 16.26,69.85 19.68,69.85 19.68,66.42 17.27,66.42 17.14,66.29 17.14,64.01 18.8,64.01 19.05,63.75 20.57,63.75
  pour Top (isolate 0.254, no thermals): 13.08,75.82 6.86,75.82 6.86,66.67 0.13,66.67 0.13,80.39 13.08,80.39
  pour Top (no thermals): 38.48,75.18 38.48,77.6 42.04,81.15 45.21,81.15 45.21,77.98 42.42,75.18 42.42,73.79 38.48,73.79
  pour Top (no thermals): 13.46,92.46 0.13,92.46 0.13,79.88 11.3,79.88 11.3,88.52 13.46,88.52
AN15V  (via drill 0.89 pad 1.27)  (1 unrouted)
  Top 0.254: 47.75,74.42 C14.-
  Top 1.27: v47.75,69.85 47.75,74.42 v47.75,77.47
  Bottom 0.61: Q2.2 R35.1
  Bottom 1.27: v47.75,69.85 J1.4R | v47.75,77.47 Q2.2
AN22VU  (1 unrouted)
AOUTLN  (via drill 0.3 pad 0.51)
  Top 0.254: U1.35 35.65,61.94 36.58,62.87 v36.58,63.88
  Bottom 0.254: R31.1 36.32,64.14 v36.58,63.88
AOUTLP  (via drill 0.3 pad 0.51)
  Top 0.254: U1.36 35.39,62.44 35.56,62.61 v35.56,63.5
  Bottom 0.254: v35.56,63.5 35.56,63.92 R30.1
AOUTRN  (via drill 0.3 pad 0.51)
  Top 0.254: U1.26 33.69,57.44 v33.27,57.02
  Bottom 0.254: R33.1 33.69,57.44 v33.27,57.02
AOUTRP  (via drill 0.3 pad 0.51)
  Top 0.254: U1.25 35.52,56.94 v36.07,56.39
  Bottom 0.254: R32.1 36.96,56.64 36.7,56.39 v36.07,56.39
AP15V  (via drill 0.51 pad 0.81)  (1 unrouted)
  Bottom 0.254: v17.14,77.72 16.41,77.72 16.41,77.06
  Bottom 1.27: J1.1L 8.38,77.47 9.14,76.71 11.09,76.71 R34.1 15.98,76.62 16.41,77.06 Q1.2
  other vias: 15.11,78.74 16.13,78.74 17.14,78.74 18.16,78.74 15.11,77.72 16.13,77.72 18.16,77.72
  pour Top (no thermals): 12.06,82.55 12.57,82.55 14.35,80.77 14.35,76.58 19.18,76.58 19.18,78.61 15.24,82.55 15.24,84.58 13.46,86.36 12.06,86.36
AP22VU  (1 unrouted)
BCK
  Top 0.254: U1.3 12.16,61.44 9.23,58.51 R36.1
BCK_CONN
  Top 0.254: J1.9L R36.2
D3V3  (via drill 0.3 pad 0.51, 0.81 pad 1.27)  (1 unrouted)
  Top 0.254: U1.15 28.73,54.64 v28.7,54.48
  Top 1.422: v14.35,46.23 14.99,45.59 v19.56,45.59
  Bottom 0.254: v28.7,54.48 28.7,51.18 31.37,48.51 50.29,48.51 53.85,52.07 | 53.85,52.07 J1.11R | J1.7R 54.23,62.23 53.98,61.98 53.98,52.2 53.85,52.07
  Bottom 1.016: v19.56,45.59 19.94,45.97 24.26,45.97 25.91,44.32 L1.1
  Bottom 1.422: J1.7L 7.49,62.23 12.45,57.28 12.45,48.13 v14.35,46.23
D3V3_ECL  (via drill 0.3 pad 0.51, 0.51 pad 0.81)
  Top 0.254: 31.24,11.69 U6.4 | 31.24,11.69 31.75,11.68 | U6.5 31.25,12.19 31.24,11.69 | 27.95,14.24 U6.14 27.95,14.74 28.45,15.24 28.96,15.24 29.46,15.75 29.46,16.32 C36.1 | U6.17 26.45,13.75 | 26.45,13.75 26.92,14.22 | 26.45,13.75 26.42,13.72
  Bottom 0.254: 35.31,9.65 35.31,8.13 v36.07,7.37
  other vias: 34.8,6.1 36.07,6.1 37.34,6.1 37.34,7.37 22.61,6.1 21.34,6.1 20.07,6.1 20.07,7.37 21.34,7.37 36.07,16 37.34,16 37.34,17.27 36.07,17.27 34.8,17.27 21.34,15.75 20.07,15.75 20.07,17.02 21.34,17.02 22.61,17.02 32,19.81 34.8,18.54 36.07,18.54 37.34,18.54 25.4,11.94 24.38,11.94 23.37,11.94 22.35,11.94
  pour Top (isolate 0.254, no thermals): 31.5,24.89 28.96,24.89 28.96,18.03 34.04,18.03 34.04,14.99 38.35,14.99 38.35,19.3 33.53,19.3 31.5,21.34
  pour Bottom: 38.35,21.59 19.05,21.59 19.05,5.33 23.37,5.33 23.37,10.41 26.16,10.41 26.16,12.95 23.37,12.95 23.37,19.05 34.04,19.05 34.04,12.95 31.24,12.95 31.24,9.91 34.04,9.91 34.04,5.33 38.35,5.33
  pour Top (no thermals): 31.24,15.24 28.96,15.24 28.96,18.29 31.24,18.29
  pour Top (no thermals): 23.37,5.33 19.05,5.33 19.05,8.89 23.37,8.89
  pour Top (no thermals): 23.37,14.99 19.05,14.99 19.05,17.53 23.37,17.53
  pour Top (no thermals): 38.35,5.33 34.04,5.33 34.04,8.89 38.35,8.89
  pour Top: 30.99,10.41 30.99,9.14 34.29,9.14 34.29,7.87 38.35,7.87 38.35,10.41
  pour Top (no thermals): 30.99,12.45 30.99,11.43 38.35,11.43 38.35,14.99 34.04,14.99 34.04,14.48 32,12.45
  pour Top (no thermals): 27.18,14.48 27.18,12.95 22.35,12.95 21.34,13.97 21.34,15.24 23.37,15.24 23.37,14.48
  pour Top (no thermals): 26.67,11.43 26.67,12.45 21.34,12.45 21.34,11.18 26.42,11.18
  pour Top (no thermals): 29.46,8.38 29.46,9.91 26.92,9.91 26.42,10.41 21.08,10.41 21.08,8.89 23.37,8.38
D3V3DAC  (via drill 0.3 pad 0.51)
  Top 0.254: U13.12 21.22,149.22 v22.48,149.22 | v46.23,148.97 46.17,149.03 U14.12 | v28.57,139.95 v28.57,150.24 | v21.72,93.85 v31.62,93.85 | v24,66.29 22.95,66.29 C79.1
  Bottom 0.254: v22.48,149.22 22.48,151.13 22.86,151.51 27.3,151.51 v28.57,150.24 32.13,146.69 45.34,146.69 45.59,146.43 46.74,146.43 46.74,148.46 v46.23,148.97 | v28.57,139.95 28.57,131.19 31.62,128.14 v31.62,93.85 | v21.72,93.85 21.72,73.41 23.24,71.88 23.24,67.06 v24,66.29
  pour Top (no thermals): 22.1,63.25 22.1,66.8 24.13,66.8 24.64,66.29 24.64,64.52 27.69,64.52 27.69,63.25
D3V3SD
  Bottom 0.406: C82.1 42.76,37.34 42.76,38.19 U22.20 | 30.06,39.71 31.24,40.89 31.24,43.78 U21.9 31.21,44.42 31.75,44.96 34.04,44.96 34.46,44.53 U21.14 | U21.1 34.46,37.67 35.05,37.08 35.81,37.08
  Bottom 0.61: 39.62,37.08 42.51,37.08 42.76,37.34 | 39.62,37.08 35.81,37.08 | 30.06,39.71 27.77,39.71 26.92,38.86 26.92,36.83 27.43,36.32 28.36,36.32 C81.1 | 34.04,44.96 38.61,44.96 39.5,44.07 39.5,37.21 39.62,37.08
  pour Bottom: 24.64,41.91 24.64,37.08 27.43,37.08 27.43,41.91
D7VU  (1 unrouted)
  pour Top (no thermals): 3.56,27.94 13.46,27.94 13.46,29.72 16.76,29.72 16.76,25.4 3.56,25.4
DGND  (via drill 0.3 pad 0.51, 0.51 pad 0.51, 0.51 pad 0.81, 0.81 pad 1.27)
  Top 0.254: 30.45,13.69 U6.9 | 30.45,13.69 U6.8 | U6.11 29.45,13.22 v29.72,12.95 | v29.72,12.95 30.45,13.69 | U6.10 29.95,13.19 | 29.95,13.19 v29.72,12.95 | 29.95,13.19 U6.7 | U6.13 28.45,13.2 v28.7,12.95 28.95,13.2 U6.12 | v27.69,12.95 27.45,13.19 U6.15 | U6.EXP v28.7,10.92 | v27.69,10.92 27.69,10.79 | U6.31 29.95,10.69 v29.72,10.92 | v25.91,9.4 26.2,9.69 U6.25 | C44.2 27.43,19.3 v26.16,18.03 | J1.20R 58.17,29.21 59.44,30.48 59.44,33.78 58.04,35.18 58.04,36.58 57.78,36.83 J1.17R | 27.69,53.85 v23.11,53.85 23.11,54.99 25.06,56.94 U1.12 | 27.69,53.85 28.96,53.85 29.73,54.62 29.73,55.12 | 27.73,55.12 27.73,53.89 27.69,53.85 | 27.73,55.12 U1.13 | 29.73,55.12 U1.17 | U1.14 28.23,55.15 28.19,55.12 27.73,55.12 | U1.16 29.21,55.7 29.21,55.12 29.73,55.12 | v23.11,49.02 23.11,45.47 20.83,43.18 20.83,37.69 U12.4
  Top 0.61: U8.4 32.77,26.67 32.64,26.8
  Top 0.813: v38.35,39.5 42.8,39.5
  Bottom 0.254: v25.91,7.37 v25.91,9.4 | v23.11,49.02 v23.11,53.85
  Bottom 0.406: U21.7 29.67,37.98 29.63,37.93 | U22.1 37.72,38.22 38.35,38.86 v38.35,39.5 38.35,43.43 37.72,44.07 U22.10
  Bottom 0.61: C81.2 29.63,37.93 29.72,37.85 29.72,37.08 31.24,35.56 40.81,35.56 C82.2
  Bottom 1.016: C77.2 22.35,36.83 20.32,38.86 20.32,43.43 21.08,44.2 22.23,44.2 C76.2
  other vias: 33.02,16.51 32,16.51 25.15,18.03 24.13,18.03 25.15,17.02 26.16,16 26.16,17.02 28.7,11.94 24.13,17.02 32.77,6.1 27.69,11.94 29.72,11.94 31.5,7.37 31.5,6.1 25.91,6.1 24.64,6.1 31.62,28.32 31.62,26.8 30.1,28.32 30.1,26.8 24.26,29.08 24.26,27.81 24.26,26.54 24.26,25.27 22.99,29.08 22.99,27.81 22.99,26.54 22.99,25.27 36.45,28.57 36.45,27.3 35.18,28.57 35.18,27.3 43.05,32.89 41.78,32.89 40.51,32.89 39.24,32.89 37.97,32.89 44.45,35.69 46.23,35.69 48.01,35.69
  pour Bottom: 33.53,5.33 23.88,5.33 23.88,9.65 26.67,9.65 26.67,13.46 23.88,13.46 23.88,18.54 33.53,18.54 33.53,13.46 30.73,13.46 30.73,9.4 33.53,9.4
  pour Top (no thermals): 33.53,7.87 23.88,7.87 23.88,5.33 33.53,5.33
  pour Top (no thermals): 23.88,14.99 23.88,18.8 28.19,18.8 28.19,14.99
  pour Top (no thermals): 33.53,14.99 33.53,17.27 31.75,17.27 31.75,14.99
  pour Top (no thermals): 26.42,5.33 26.42,0.64 15.75,0.64 15.75,6.6 18.29,6.6 18.29,4.83 23.88,4.83 23.88,5.33
  pour Top (isolate 0.254, no thermals): 27.81,29.84 27.81,18.92 16.13,18.92 16.26,24.64 17.27,24.64 17.27,33.53 19.05,33.53 19.05,25.4 22.61,25.4 22.61,29.84
  pour Top: 22.73,25.02 19.18,25.02 19.18,22.73 22.73,22.73
  pour Top (isolate 0.254, no thermals): 43.81,33.66 43.81,26.8 36.96,26.8 36.96,21.46 33.91,21.46 33.91,26.04 29.59,26.04 29.59,28.83 33.15,28.83 33.15,33.66
  pour Top (isolate 0.254): 7.62,60.96 7.62,28.7 2.54,28.7 2.54,24.64 16.51,24.64 16.51,0.25 0.51,0.25 0.51,60.96
  pour Top (isolate 0.254): 48.01,60.71 60.71,60.71 60.71,35.81 48.77,35.81 48.77,25.65 42.16,25.65 42.16,51.82 48.01,51.82
  pour Bottom: 20.83,34.04 44.2,34.04 44.2,22.61 20.83,22.61
  pour Top (no thermals): 21.59,43.94 21.59,34.29 11.94,34.29 11.94,43.94
  pour Bottom (isolate 0.254, no thermals): 20.7,34.67 48.77,34.67 48.77,36.45 48.64,36.58 23.62,36.58 23.62,39.75 20.57,39.75 20.57,34.67
HWCON  (via drill 0.3 pad 0.51)
  Top 0.254: v38.61,38.1 v44.07,38.1
  Bottom 0.254: U21.2 33.81,38.77 33.91,38.86 34.8,38.86 35.94,37.72 38.23,37.72 v38.61,38.1 | v44.07,38.1 51.44,38.1 53.98,35.56 59.05,35.56 60.33,36.83 60.33,49.78 58.67,51.44 58.67,56.39 57.91,57.15 J1.9R
HWCON0  (via drill 0.3 pad 0.51)
  Top 0.254: U13.1 15.42,151.89 16.26,151.89 v16.51,152.15 | v38.35,151.64 39.28,151.64 U14.1 | v29.21,139.32 v29.21,152.78 | v32.26,94.49 37.34,89.41 46.1,89.41 49.4,86.11 49.4,69.6 50.42,68.58 57.66,68.58 58.04,68.2 v58.04,45.72
  Bottom 0.254: v16.51,152.15 17.14,152.78 v29.21,152.78 29.08,152.78 29.72,152.15 33.27,152.15 33.78,152.65 33.78,153.16 34.04,153.42 37.85,153.42 38.35,152.91 v38.35,151.64 | v29.21,139.32 29.21,131.95 32.26,128.91 v32.26,94.49 | v58.04,45.72 48.39,45.72 43.49,40.82 U22.16
HWCON1  (via drill 0.3 pad 0.51)
  Top 0.254: U13.16 22.62,151.88 v23.62,150.88 | v46.23,151.64 45.73,151.63 U14.16 | v29.84,139.95 v29.84,147.96 | v32.89,95.25 38.1,90.04 46.48,90.04 50.04,86.49 50.04,71.88 50.8,71.12 57.4,71.12 58.67,69.85 v58.67,43.18
  Bottom 0.254: v23.62,150.88 26.92,150.88 v29.84,147.96 31.75,146.05 44.83,146.05 45.02,145.86 47.05,145.86 47.24,146.05 47.24,150.62 v46.23,151.64 | v32.89,95.25 32.89,129.54 29.84,132.59 v29.84,139.95 | v58.67,43.18 50.67,43.18 47.67,40.17 U22.17
HWCON2  (via drill 0.3 pad 0.51)
  Top 0.254: U13.9 21.17,147.32 v22.73,147.32 | v44.7,145.16 45.04,145.5 U14.9 | v30.48,139.32 v30.48,145.41 | v33.53,96.14 38.99,90.68 46.99,90.68 50.67,87 50.67,74.17 51.18,73.66 58.17,73.66 59.31,72.52 59.31,42.16 v57.78,40.64
  Bottom 0.254: v22.73,147.32 22.99,147.57 25.4,147.57 27.56,145.41 v30.48,145.41 40.77,145.41 41.02,145.16 v44.7,145.16 | v30.48,139.32 30.48,133.35 33.53,130.3 v33.53,96.14 | v57.78,40.64 49.53,40.64 48.41,39.52 U22.18
HWCON3  (via drill 0.3 pad 0.51)
  Top 0.254: U13.8 15.49,147.25 v15.49,146.18 | v40.13,144.78 39.29,145.62 U14.8 | v31.11,139.95 v31.11,144.78 | v34.16,97.03 39.75,91.44 47.24,91.44 51.31,87.38 51.31,77.34 52.58,76.07 57.78,76.07 59.94,73.91 59.94,40.26 v57.78,38.1
  Bottom 0.254: v15.49,146.18 16.89,144.78 v31.11,144.78 v40.13,144.78 | v31.11,139.95 31.11,133.99 34.16,130.94 v34.16,97.03 | v57.78,38.1 52.58,38.1 51.8,38.87 U22.19
LRCK
  Top 0.254: U1.5 16.5,60.44 9.23,53.17 R37.1
LRCK_CONN
  Top 0.254: J1.11L R37.2
MCLK  (via drill 0.3 pad 0.51)
  Top 0.254: R10.1 v17.53,18.29 | U1.46 28.73,62.77 v28.7,62.74
  Bottom 0.254: v17.53,18.29 17.53,57.91 23.5,63.88 27.56,63.88 v28.7,62.74
MCLKN
  Top 0.254: 43.78,12.19 C33.2 44.28,11.18 46.35,11.18 51.18,16 51.18,32 52.32,33.15 54.36,33.15 55.5,34.29 J1.18R
MCLKP
  Top 0.254: 43.78,9.65 C34.2 44.28,10.67 46.61,10.67 51.69,15.75 51.69,31.75 52.58,32.64 54.36,32.64 55.24,31.75 J1.19R
MOSI
  Top 0.254: J1.18L 7.11,34.29 12.95,40.13 12.95,49.28 22.12,58.44 U1.9
N$1
  Top 0.254: U2.2 U2.3
N$2
  Top 0.254: R7.1 R8.2 29.46,103 29.08,102.62 R65.1 28.74,99.82 C28.2
N$3
  Top 0.254: R6.1 26.92,109.51 R7.2 26.76,107.02 25.4,105.66 25.4,104.43 C27.2
N$4
  Top 0.254: C26.1 23.66,109.6 R6.2 25.31,107.65 R5.1
N$5
  Top 0.254: R5.2 U2.4
N$6
  Top 0.254: U7.7 R15.1
N$7
  Top 0.254: U2.7 R4.1
N$8
  Bottom 0.254: R30.2 34.29,80.52 26.42,88.39 26.42,94.61 C28.1
N$9
  Bottom 0.254: R33.2 34.67,60.33 38.86,64.52 38.86,94.49 37.59,95.76 37.59,133.99 C69.1
N$11
  Top 0.254: U6.23 21.44,10.69 R12.2
N$12
  Top 0.254: U7.2 U7.3
N$13
  Top 0.254: R18.1 R19.2 29.46,126.62 28.96,126.11 R64.1 28.74,123.44 C53.2
N$14
  Top 0.254: R9.2 38.77,9.91 | U6.2 38.25,10.69 R9.2 | R9.2 41.66,10.07 C34.1
N$15
  Top 0.254: U6.3 38.28,11.19 R9.1 41.66,11.77 C33.1
N$16
  Top 0.254: R17.1 26.92,133.13 R18.2 26.76,130.64 25.4,129.29 25.4,128.06 C52.2
N$17
  Top 0.254: C51.1 23.66,133.22 R17.2 25.31,131.27 R16.1
N$18
  Top 0.254: R16.2 19.47,131.19 U7.4
N$19
  Top 0.61: U8.1 28.96,23.62 28.57,23.24 26.16,23.24 C41.1
N$20
  Bottom 0.254: R32.2 36.96,61.34 40.89,65.28 40.89,95.76 39.37,97.28 39.37,112.9 C61.1
N$21
  Bottom 0.254: R31.2 36.32,81.28 28.19,89.41 28.19,116.46 C53.1
N$22
  Top 0.254: U6.19 22.45,12.69 20.66,14.48 18.45,14.48 R10.2
N$23
  Top 0.254: U9.7 R20.1
N$24
  Bottom 0.61: C70.- 47.11,94.95 D1.A 47.75,91.05 R35.2 47.59,89.66 46.48,89.66 45.47,88.65 Q2.1
N$25
  Top 0.254: U6.22 21.41,11.19 R13.2
N$26
  Top 0.61: U8.3 31.5,22.86 33.66,20.7 35.11,20.7 C43.1 34.99,20.7
  Top 1.27: C43.1 37.43,20.77 C45.+
N$27
  Top 0.254: U6.32 33.24,9.69 33.78,9.14 33.78,5.33 32.93,4.48 R11.2
N$28
  Top 0.61: U8.6 U8.5 35.06,30.3 C42.1
N$29
  Top 0.254: R13.1 R12.1 18.03,8.98 18.03,7.87 18.12,7.71 R14.1 17.61,7.71
N$30
  Top 0.254: U9.2 U9.3
N$31
  Top 0.254: R23.1 R24.2 33.02,111.63 32.89,111.76 R62.1 35.22,113.83 C61.2
N$32
  Top 0.254: R22.1 35.56,105.12 R23.2 35.73,107.61 37.08,108.97 37.08,110.2 C60.2
N$33
  Top 0.254: C59.1 38.82,105.03 R22.2 37.17,106.98 R21.1
N$34
  Top 0.254: R21.2 43.01,107.06 U9.4
N$35
  Bottom 0.61: C31.1 49.91,92.74 U4.3 U4.2
  Bottom 1.27: Q2.3 50.03,91.06 C31.1
N$36
  Top 0.254: U10.7 R25.1
N$37
  Bottom 1.27: R34.2 D2.C 11.81,81.28 13.21,81.28 14.48,82.56 Q1.1 14.48,85.01 C5.+
N$38
  Top 0.254: U10.2 U10.3
N$39
  Top 0.254: R28.1 R29.2 33.02,134.49 33.4,134.87 R63.1 33.74,137.67 C69.2
N$40
  Top 0.254: R27.1 35.56,127.98 R28.2 35.73,130.47 37.08,131.83 37.08,133.06 C68.2
N$41
  Top 0.254: C67.1 38.82,127.89 R27.2 37.17,129.84 R26.1
N$42
  Top 0.254: R26.2 43.01,129.92 U10.4
N$43  (via drill 3.17 pad 6.35)
  other vias: 5.08,156.21
N$44
  Bottom 0.61: C29.1 16.7,90.87 | 16.7,90.87 U3.1 | U3.3 14.8,91.12 15.24,90.68 16.5,90.68 16.7,90.87
  Bottom 1.27: Q1.3 19.18,83.68 C29.1
N$45  (via drill 3.17 pad 6.35)
  other vias: 55.88,156.21
N$47
  Top 0.254: R45.1 12.53,151.13 14.22,151.13 14.77,150.58 U13.3
N$48  (via drill 0.3 pad 0.51)
  Top 0.254: v24.38,152.15 R40.2 | U13.2 17.53,151.23 v17.53,152.15
  Bottom 0.254: v17.53,152.15 v24.38,152.15
N$49
  Top 0.254: R55.1 37.08,151.89 38.65,150.33 U14.3
N$50  (via drill 0.3 pad 0.51)
  Top 0.254: R47.1 v13.21,148.59 | v20.07,148.59 20.11,148.63 U13.11
  Bottom 0.254: v13.21,148.59 v20.07,148.59
N$51
  Top 0.254: R42.2 25.21,147.98 U13.10
N$52
  Top 0.254: U13.15 22,151.23 22.99,150.24 24.26,150.24 24.38,150.37 R41.2
N$53  (via drill 0.3 pad 0.51)
  Top 0.254: v24.38,146.81 R43.2 | U13.7 16.51,147.98 v16.51,146.81
  Bottom 0.254: v16.51,146.81 22.23,146.81 22.35,146.69 23.24,146.69 23.37,146.81 v24.38,146.81
N$54
  Top 0.254: R48.1 12.28,147.57 13.46,147.57 14.48,148.59 15.37,148.59 U13.6
N$55  (via drill 0.3 pad 0.51)
  Top 0.254: R46.1 v13.97,150.37 | v20.07,150.37 20.32,150.62 21.12,150.62 U13.14
  Bottom 0.254: v13.97,150.37 v20.07,150.37
N$56
  Bottom 0.254: U22.2 35.68,38.87 35.18,39.37 33.53,39.37 33.16,39 U21.3
N$57
  Bottom 0.254: U22.3 35.79,39.52 35.43,39.88 33.27,39.88 32.51,39.12 U21.4
N$58
  Bottom 0.254: U22.4 35.9,40.17 35.69,40.39 32.77,40.39 31.86,39.48 U21.5
N$59
  Bottom 0.254: U22.5 36.01,40.82 35.94,40.89 32.26,40.89 31.21,39.85 U21.6
N$60
  Bottom 0.254: U22.6 35.63,41.47 35.56,41.4 32.77,41.4 31.86,42.31 U21.10
N$61
  Bottom 0.254: U21.11 32.51,42.42 33.02,41.91 35.31,41.91 35.56,42.16 36.92,42.16 U22.7
N$62
  Bottom 0.254: U22.8 35.41,42.77 35.05,42.42 33.53,42.42 33.16,42.78 U21.12
N$63
  Bottom 0.254: U21.13 33.81,43.15 34.04,42.93 34.8,42.93 35.31,43.43 36.95,43.43 U22.9
N$64
  Bottom 1.016: C76.1 22.35,40.04 R60.1
N$65  (via drill 0.3 pad 0.51)
  Top 0.254: v43.94,150.37 43.98,150.33 U14.14 | R56.1 36.16,150.88 v37.08,150.88
  Bottom 0.254: v37.08,150.88 37.59,150.37 v43.94,150.37
N$66  (via drill 0.3 pad 0.51)
  Top 0.254: v43.94,148.59 44.16,148.38 U14.11 | R57.1 v36.32,148.34
  Bottom 0.254: v36.32,148.34 36.58,148.59 v43.94,148.59
N$67
  Top 0.254: U14.6 38.48,148.38 36.66,146.56 R58.1
N$68  (via drill 0.3 pad 0.51)
  Top 0.254: v40.64,147.83 40.54,147.73 U14.7 | R53.2 47.62,146.56 47.12,147.07 v46.1,147.07
  Bottom 0.254: v46.1,147.07 45.34,147.83 v40.64,147.83
N$69
  Top 0.254: R52.2 48.33,147.73 U14.10
N$70
  Top 0.254: R51.2 48.07,150.98 U14.15
N$71  (via drill 0.3 pad 0.51)
  Top 0.254: v40.39,151.13 40.23,150.98 U14.2 | R50.2 47.75,151.89 47.24,152.4 v46.74,152.4
  Bottom 0.254: v46.74,152.4 45.72,152.4 45.21,151.89 40.64,151.89 40.39,151.64 v40.39,151.13
N$72
  Top 0.254: U15.7 44.57,61.59 45.85,62.87 45.85,63.33 R3.2
  pour Top (no thermals): 45.97,67.56 45.97,64.52 45.34,63.88 45.34,62.61 44.58,61.85 44.6,60.88 44.73,60.88 44.7,61.72 45.21,62.23 46.61,62.23 47.62,63.25 47.62,67.56
N$73
  Bottom 0.254: U16.7 11.3,68.58 10.07,69.81 R61.2
  pour Bottom (no thermals): 7.49,74.55 9.65,74.55 9.65,72.39 10.67,71.37 10.67,69.22 11.3,68.58 11.3,67.82 11.18,67.82 11.18,68.58 11.05,68.58 10.29,69.34 9.14,69.34 7.49,70.99
ON5V  (via drill 0.3 pad 0.51)
  Top 0.254: R63.2 v33.4,141.6 | R62.2 32.89,117.73 32.51,118.11 v30.48,118.11 29.84,118.11 29.72,117.98 | R64.2 30.44,121.96 v30.48,121.92 | R65.2 45.51,98.46 45.59,98.55 45.59,97.16 v45.47,97.03
  Top 0.305: U2.5 16.14,107.56 15.75,107.95 15.75,110.32 C24.2 | U7.5 16.14,131.18 15.75,131.57 15.75,133.95 C49.2 | U9.5 46.34,107.07 46.74,106.68 46.74,104.31 C57.2 | U10.5 46.34,129.93 46.74,129.54 46.74,127.17 C65.2
  Bottom 0.254: 10.16,118.62 10.16,119.38 | 52.83,120.9 52.58,120.9 52.58,119.13 | v33.4,141.6 34.16,141.6 | v30.48,118.11 v30.48,121.92
  Bottom 0.61: C32.1 55.53,96.3 U4.5
  other vias: 12.7,103.12 11.68,103.12 12.7,104.14 11.68,104.14 11.94,108.46 10.92,108.46 12.7,126.75 11.68,126.75 12.7,127.76 11.68,127.76 11.94,132.08 10.92,132.08 49.78,111.51 50.8,111.51 49.78,110.49 50.8,110.49 50.55,106.17 51.56,106.17 49.78,134.37 50.8,134.37 49.78,133.35 50.8,133.35 50.55,129.03 51.56,129.03 44.7,97.03 46.23,97.03 46.99,97.03 15.24,141.22 16,141.22 16.76,141.22 17.53,141.22 19.3,144.02 20.07,144.02 43.18,144.02 43.94,144.02
  pour Top (no thermals): 16.13,107.44 16.13,109.86 18.03,109.86 18.03,117.47 14.86,117.47 14.86,108.71
  pour Bottom: 14.22,102.87 9.4,102.87 9.4,108.97 12.7,108.97 12.7,107.7 11.68,107.7 11.68,104.65 14.22,104.65
  pour Top (no thermals): 14.22,102.87 11.43,102.87 11.43,104.65 14.22,104.65
  pour Top: 14.99,109.22 9.4,109.22 9.4,107.7 12.7,107.7 12.7,108.71 14.99,108.71
  pour Top (no thermals): 16.13,131.06 16.13,133.48 18.03,133.48 18.03,141.6 14.86,141.6 14.86,132.33
  pour Bottom: 14.22,126.49 9.4,126.49 9.4,132.59 12.7,132.59 12.7,131.32 11.68,131.32 11.68,128.27 14.22,128.27
  pour Top (no thermals): 14.22,126.49 11.43,126.49 11.43,128.27 14.22,128.27
  pour Top: 14.99,132.84 9.4,132.84 9.4,131.32 12.7,131.32 12.7,132.33 14.99,132.33
  pour Top (no thermals): 46.35,107.19 46.35,104.78 44.45,104.78 44.45,96.65 47.62,96.65 47.62,105.92
  pour Bottom: 48.26,111.76 53.09,111.76 53.09,105.66 49.78,105.66 49.78,106.93 50.8,106.93 50.8,109.98 48.26,109.98
  pour Top (no thermals): 48.26,111.76 51.05,111.76 51.05,109.98 48.26,109.98
  pour Top: 47.5,105.41 53.09,105.41 53.09,106.93 49.78,106.93 49.78,105.92 47.5,105.92
  pour Top (no thermals): 46.35,130.05 46.35,127.64 44.45,127.64 44.45,120.02 47.62,120.02 47.62,128.78
  pour Bottom: 48.26,134.62 53.09,134.62 53.09,128.52 49.78,128.52 49.78,129.79 50.8,129.79 50.8,132.84 48.26,132.84
  pour Top (no thermals): 48.26,134.62 51.05,134.62 51.05,132.84 48.26,132.84
  pour Top: 47.5,128.27 53.09,128.27 53.09,129.79 49.78,129.79 49.78,128.78 47.5,128.78
  pour Top (isolate 0.254): 14.73,117.35 42.16,117.35 43.69,118.87 47.75,118.87 47.75,120.14 41.91,120.14 40.13,118.36 14.73,118.36
  pour Bottom: 9.4,126.49 9.4,108.97 10.67,108.97 10.67,126.49
  pour Bottom: 53.09,128.52 51.82,128.52 51.82,111.76 53.09,111.76
  pour Bottom (isolate 0.254, no thermals): 44.45,97.28 53.09,97.28 53.09,95.25 44.2,95.25 44.2,97.28
  pour Top (isolate 0.254, no thermals): 14.73,150.11 18.29,150.11 20.32,148.08 20.32,143.76 19.05,143.76 19.05,148.08 17.27,149.86 14.73,149.86
  pour Top (isolate 0.254, no thermals): 38.86,149.86 38.86,149.61 40.89,149.61 42.93,147.57 42.93,143.76 44.2,143.76 44.2,147.32 41.66,149.86
  pour Bottom (isolate 0.254, no thermals): 14.73,140.97 38.61,140.97 41.4,143.76 44.2,143.76 44.2,144.27 14.73,144.27
OP5V  (via drill 0.3 pad 0.51)
  Top 0.254: U7.1 21.07,129.68 21.08,129.67 21.08,127.89 15.75,127.89 | U10.1 41.41,131.43 41.4,131.44 41.4,133.22 46.74,133.22 | U2.1 21.07,106.06 21.08,106.05 21.08,104.27 15.75,104.27 | U9.1 41.41,108.57 41.4,108.58 41.4,110.36 46.74,110.36
  Top 0.305: U2.8 16.14,106.06 15.75,105.66 15.75,104.27 15.75,103.8 C23.1 | U7.8 16.14,129.68 15.75,129.29 15.75,127.89 15.75,127.42 C48.1 | U9.8 46.34,108.57 46.74,108.97 46.74,110.36 46.74,110.83 C56.1 | U10.8 46.34,131.43 46.74,131.83 46.74,133.22 46.74,133.69 C64.1
  Bottom 0.61: C30.1 19.4,94.77 U3.5 U3.4
  other vias: 15.24,120.14 16,120.14 16.76,120.14 17.53,120.14 15.24,96.52 16,96.52 16.76,96.52 17.53,96.52 44.96,118.11 45.72,118.11 46.48,118.11 47.24,118.11 44.96,140.97 45.72,140.97 46.48,140.97 47.24,140.97 20.57,120.14 21.34,120.14 20.57,119.38 21.34,119.38 22.1,120.14 22.1,119.38 38.86,120.14 39.62,120.14 38.86,119.38 39.62,119.38 20.07,153.67 20.83,153.67 21.59,153.67 44.96,153.16 44.2,153.16 44.2,153.92 44.96,153.92
  pour Top (isolate 0.254, no thermals): 18.03,96.27 14.86,96.27 14.86,104.9 16.13,106.17 16.13,104.27 18.03,104.27
  pour Top (isolate 0.254, no thermals): 18.03,119.89 14.86,119.89 14.86,128.52 16.13,129.79 16.13,127.89 18.03,127.89
  pour Top (isolate 0.254, no thermals): 44.45,118.36 47.62,118.36 47.62,109.73 46.35,108.46 46.35,110.36 44.45,110.36
  pour Top (isolate 0.254, no thermals): 44.45,141.73 47.62,141.73 47.62,132.59 46.35,131.32 46.35,133.22 44.45,133.22
  pour Bottom (isolate 0.254, no thermals): 14.73,120.4 22.61,120.4 25.4,117.6 25.4,105.92 20.32,100.84 20.32,94.23 14.73,94.23 14.73,96.77 19.3,96.77 19.3,102.62 23.88,107.19 23.88,116.59 21.84,118.62 14.73,118.62
  pour Bottom: 47.75,117.86 38.61,117.86 38.61,120.65 39.62,120.65 40.13,120.14 47.75,120.14
  pour Top: 20.32,120.65 20.32,119.13 39.88,119.13 39.88,120.65
  pour Bottom: 47.5,140.72 43.43,140.72 43.18,140.46 43.18,130.05 39.88,126.75 39.88,120.4 38.61,120.4 38.61,121.67 38.86,121.92 38.86,129.03 42.16,132.33 42.16,140.72 42.93,141.48 47.5,141.48
  pour Top (isolate 0.254, no thermals): 21.59,149.61 19.56,149.61 18.29,150.88 18.29,154.18 22.1,154.18 22.1,152.91 19.56,152.91 19.56,151.13 20.57,150.11 21.59,150.11
  pour Top (isolate 0.254, no thermals): 45.47,149.61 42.93,149.61 42.42,150.11 42.42,154.18 45.21,154.18 45.21,152.91 43.94,152.91 43.94,150.11 44.2,149.86 45.47,149.86
  pour Bottom (isolate 0.254, no thermals): 18.29,155.19 18.29,152.91 33.53,152.91 33.53,153.92 38.35,153.92 38.35,152.91 45.21,152.91 45.21,155.19
  pour Bottom (isolate 0.254, no thermals): 42.16,140.72 49.78,140.72 49.78,155.19 43.18,155.19 43.18,152.91 47.5,152.91 47.5,143 42.16,143
OUTLN
  Top 0.254: 9.91,130.18 R15.2 | 9.91,130.18 7.91,130.18 C50.1 4.41,130.21 3.05,131.57 3.05,138.18 7.62,142.75 24.89,142.75 25.82,143.68 R44.2 | C52.1 19.3,123.66 19.3,120.65 18.03,119.38 11.43,119.38 9.91,120.9 9.91,130.18
OUTLN_ATT
  Top 0.254: R44.1 R43.1 R42.1 R41.1 R40.1 27.52,153.84 26.42,154.94 19.81,154.94 19.3,155.45 J3.2
OUTLP
  Top 0.254: 9.91,106.55 R4.2 | 9.91,106.55 7.91,106.55 C25.1 7.79,106.68 6.35,106.68 2.03,111 2.03,138.43 7.11,143.51 11.43,143.51 11.43,144.95 R49.2 | C27.1 19.3,100.04 19.3,97.03 18.03,95.76 11.43,95.76 9.91,97.28 9.91,106.55
OUTLP_ATT
  Top 0.254: R49.1 R48.2 R47.2 R46.2 R45.2 9.91,152.23 9.91,153.67 11.18,154.94 16.51,154.94 16.76,155.19 J3.3
OUTRN
  Top 0.254: 52.58,130.94 54.57,130.94 C66.1 | C68.1 43.18,137.45 43.18,140.46 43.31,140.59 | 43.31,140.59 44.45,141.73 51.05,141.73 52.07,140.72 52.07,136.14 52.58,135.64 52.58,130.94 | 52.58,130.94 R25.2 | R59.2 39.12,144.78 43.31,140.59
OUTRN_ATT
  Top 0.254: J2.2 40.64,155.7 39.88,154.94 34.54,154.94 33.78,154.18 33.78,151.98 R55.2 R56.2 R57.2 R58.2 R59.1
OUTRP
  Top 0.254: 52.58,108.08 R20.2 | 52.58,108.08 54.57,108.08 C58.1 | C60.1 43.18,114.59 43.18,117.6 44.45,118.87 51.05,118.87 52.58,117.35 | 52.58,117.35 52.58,108.08 | R54.2 48.93,143.6 49.78,142.75 52.07,142.75 56.39,138.43 56.39,121.16 52.58,117.35
OUTRP_ATT
  Top 0.254: R54.1 R53.1 R52.1 R51.1 R50.1 50.63,154.34 50.04,154.94 43.94,154.94 43.18,155.7 J2.3
PREREG
  pour Top (isolate 0.254, no thermals): 19.56,26.16 21.84,26.16 21.84,30.48 28.45,30.48 28.45,29.46 30.73,29.46 30.73,33.53 19.56,33.53
SCLK  (via drill 0.3 pad 0.51)
  Top 0.254: v20.57,57.91 21.6,58.94 U1.8
  Bottom 0.254: J1.13R 23.37,46.99 20.57,49.78 v20.57,57.91
SDATA0
  Top 0.254: U1.4 15.22,60.94 7.62,53.34 3.3,53.34 2.54,52.58 R38.1
SDATA0_CONN
  Top 0.254: R38.2 2.96,49.53 J1.12L
SDATA1
  Top 0.254: U1.6 19.81,59.94 9.23,49.36 R39.1
SDATA1_CONN
  Top 0.254: J1.13L R39.2
SRCLK  (via drill 0.3 pad 0.51)
  Top 0.254: v41.27,40.89 v44.58,40.89
  Bottom 0.254: J1.14R 49.91,44.45 46.35,40.89 v44.58,40.89 | v41.27,40.89 40.39,41.78 40.39,44.96 39.37,45.97 31.5,45.97 30.56,45.04 U21.8
SRCLK2  (via drill 0.3 pad 0.51)
  Top 0.254: v51.31,46.35 v51.31,41.91
  Bottom 0.254: v51.31,41.91 J1.15R | v51.31,46.35 47.5,46.35 45.22,44.07 U22.11
VCML
  Top 0.254: C11.1 33.69,66.33 33.78,66.42 33.53,65.66 32.77,64.9 32.77,63.7 U1.38
  pour Top (no thermals): 32.77,63.5 32.77,64.9 33.27,65.41 33.27,70.36 33.53,70.61 35.81,70.61 35.81,68.58 34.29,67.06 34.29,66.17 32.89,64.77 32.89,63.63
VCMR
  Top 0.254: 33.53,53.98 33.53,52.87 C3.1
  Top 0.305: U1.23 32.73,54.77 33.53,53.98
  pour Top (no thermals): 32.82,54.56 33.27,54.1 33.27,48.51 35.81,48.51 35.81,50.67 34.29,52.2 34.29,53.34 33.07,54.56
VREFL
  Top 1.016: R1.2 30.63,75.06 C6.+
  pour Top (no thermals): 31.24,63.25 31.24,70.36 32.26,71.37 32.26,78.74 29.21,78.74 29.21,71.37 30.23,70.36 30.23,65.28 30.73,64.77 30.73,63.25
  pour Top (no thermals): 29.21,78.74 29.21,78.49 32.26,78.49 32.26,78.74
VREFR
  pour Top (no thermals): 31.24,56.13 31.24,50.04 27.43,46.23 24.38,46.23 24.38,52.58 29.46,52.58 29.97,53.09 29.97,54.1 30.73,54.86 30.73,56.13
  pour Top (no thermals): 24.89,50.55 24.89,52.58 19.43,52.58 19.43,50.55

## Text on the board
tPlace: P | N | N | P | Left Output | Right Output | 2-ch DAC (AK4490) | M. Price